# EAGLE design 3DR-APM25-Power-Module-V10 (EAGLE 6.3)
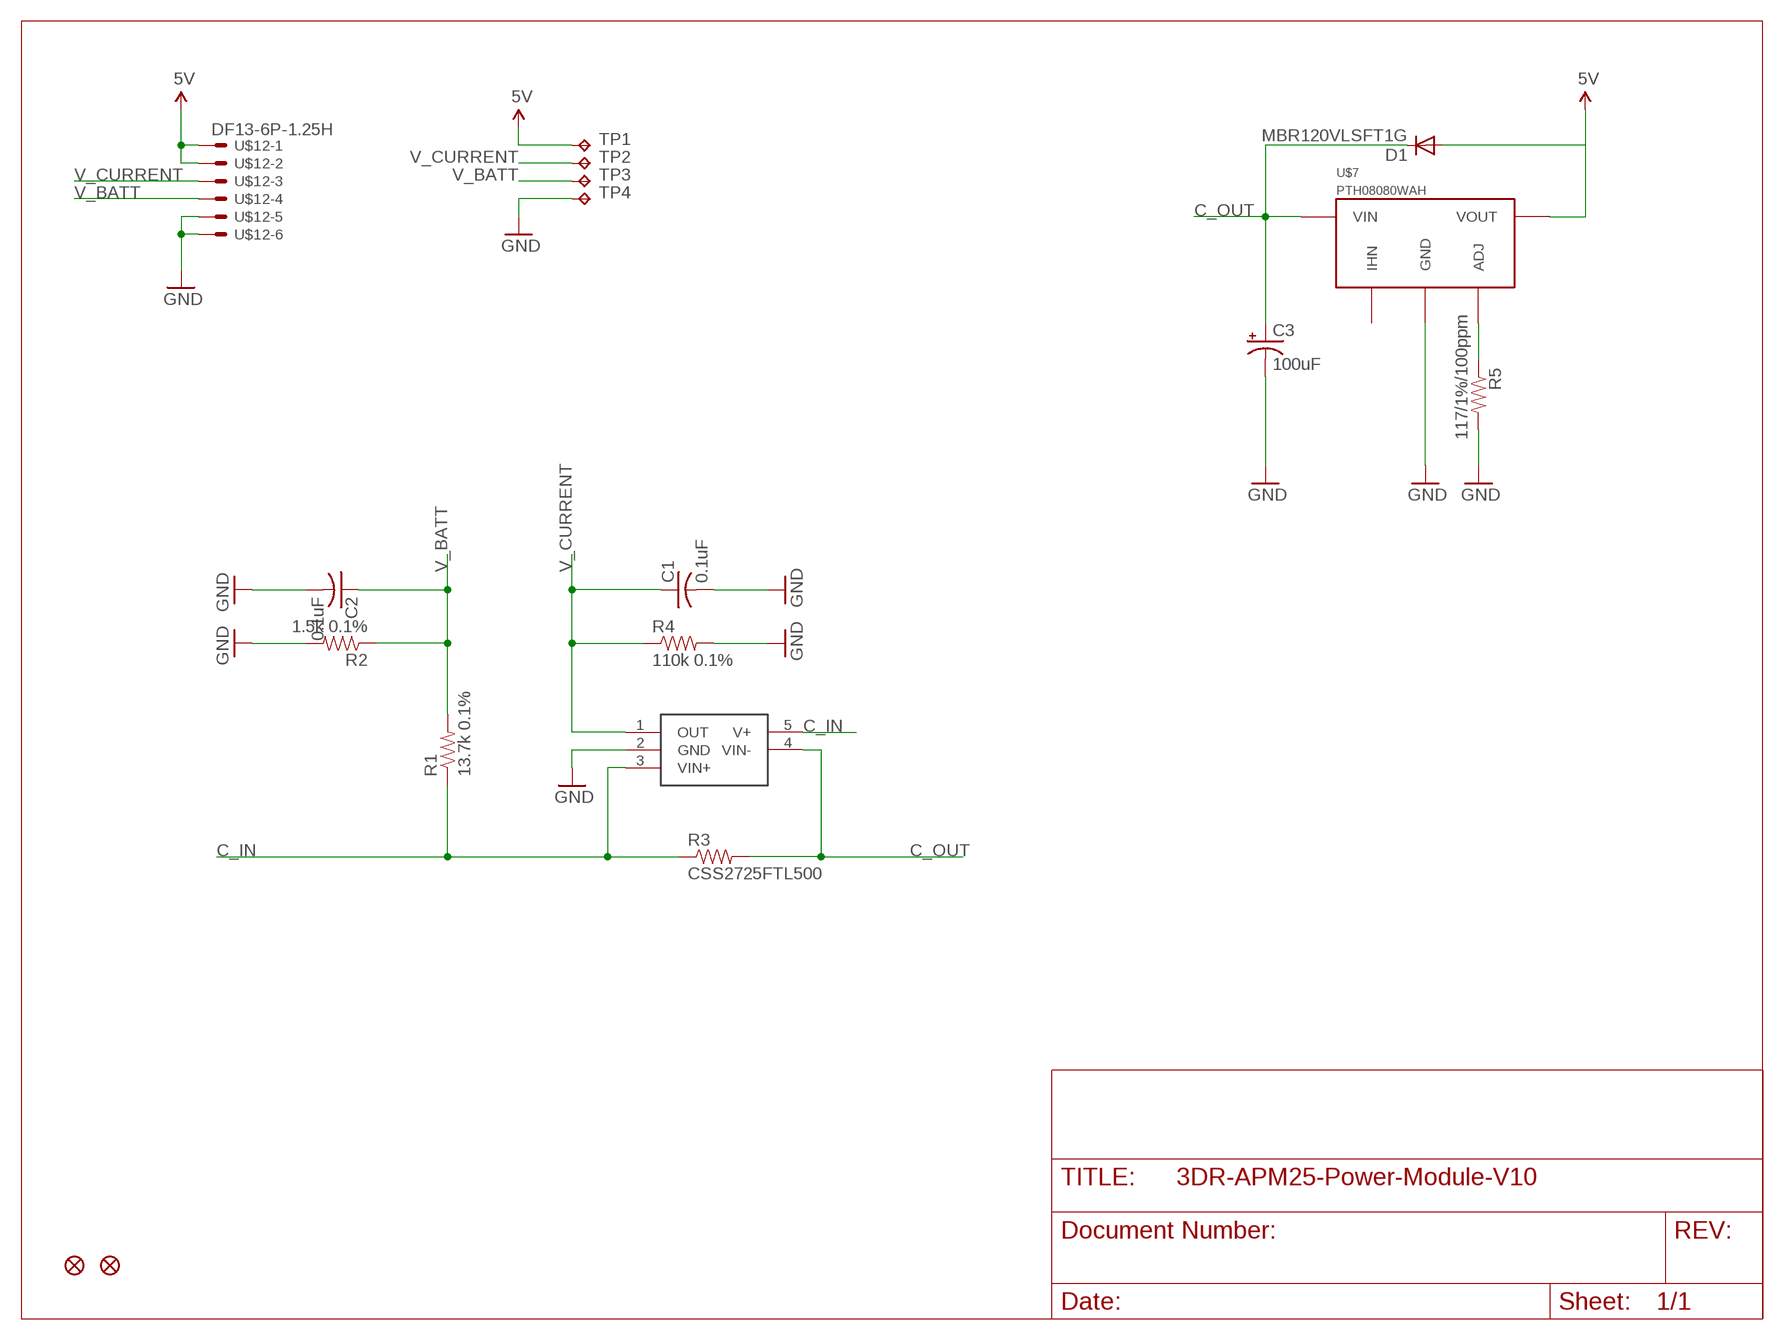
[diagram p0: schematic, sheet 1]

## Parts
C1  0.1uF  C-USC0402  [C0402]
C2  0.1uF  C-USC0402  [C0402]
C3  100uF  CAP_POL7343  [EIA7343]
D1  MBR120VLSFT1G  DIODE-SOD-123  [SOD-123-DIO]
JP1  FIDUCIAL1X2  [FIDUCIAL-1X2]
JP2  FIDUCIAL1X2  [FIDUCIAL-1X2]
R1  13.7k 0.1%  RESISTOR0402-RES  [0402-RES]
R2  1.5k 0.1%  RESISTOR0402-RES  [0402-RES]
R3  CSS2725FTL500  CSS2725FTL250  [2725-RES]
R4  110k 0.1%  RESISTOR0402-RES  [0402-RES]
R5  117/1%/100ppm  RESISTOR0402-RES  [0402-RES]
TP1  TPTP19SQ  [TP19SQ]
TP2  TPTP19SQ  [TP19SQ]
TP3  TPTP19SQ  [TP19SQ]
TP4  TPTP19SQ  [TP19SQ]
U$2  INA169  [SOT23-5]
U$7  PTH08080WAH  [PTH08080W_TH]
U$12  DF13-6P-1.25H  [DF13A-6P-1.25H]

## Nets
C_IN: R1.1 R3.P$1 U$2.3(VIN+) U$2.5(V+)
C_OUT: C3.A(+) D1.C R3.P$2 U$2.4(VIN-) U$7.1(VIN)
GND: C1.2 C2.2 C3.C(-) R2.2 R4.2 R5.2 TP4.TP U$2.2(GND) U$7.2(GND) U$12.5 U$12.6
N$1: R5.1 U$7.4(ADJ)
V_BATT: C2.1 R1.2 R2.1 TP3.TP U$12.4
V_CURRENT: C1.1 R4.1 TP2.TP U$2.1(OUT) U$12.3
VDD_5V: D1.A TP1.TP U$7.3(VOUT) U$12.1 U$12.2 ; supply symbol labelled 5V
Unconnected: U$7.5(IHN)

## Library data of the parts
C1 C2 = adafruit:C-US: CAPACITOR, American symbol
C3 = pixhawk2:CAP_POL: Capacitor Polarized These are standard SMD and PTH capacitors. Normally 10uF, 47uF, and 100uF in electrolytic and tantalum varieties. Always verify the external diameter of the through hole cap, it varies with capacity, voltage, and manufacturer. The EIA devices should be standard.
D1 = pel_dipol_comp:DIODE
JP1 JP2 = SparkFun:FIDUCIAL: Fiducial Alignment Points Various fiducial points for machine vision alignment.
R1 R2 R4 R5 = SparkFun:RESISTOR: Resistor Basic schematic elements and footprints for 0603, 1206, and PTH resistors.
R3 = SparkFun:CSS2725FTL250; DIGIKEY: http://search.digikey.com/us/en/products/CSS2725FTL250/CSS2725FTL250CT-ND/1923235; MFGPN: CSS2725FTL250
TP1-TP4 = testpad:TP: Test pad
U$2 = SparkFun:INA169
U$7 = pixhawk2:PTH08080W: 2.25-A, WIDE-INPUT ADJUSTABLE SWITCHING REGULATOR The input voltage range of the PTH08080W is from 4.5 V to 18 V, allowing operation from either a 5-V or 12-V input bus. Using state-of-the-art switched-mode power-conversion technology, the PTH08080W can step down to voltages as low as 0.9 V from a 5-V input bus, with less than 1 W of power dissipation. The output voltage can be adjusted to any voltage over the range, 0.9 V to 5.5 V, using a single external resistor. Operating features include an undervoltage lockout (UVLO), on/off inhibit, overcurrent protection, and overtemperature protection. http://focus.ti.com/lit/ds/symlink/pth08080w.pdf
U$12 = pixhawk2:DF13-6P-1.25?

## Board
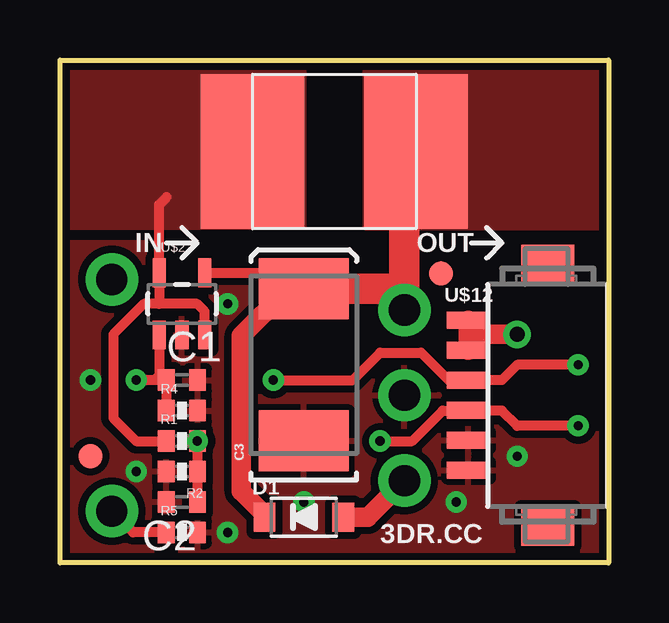
[diagram p1: board, top side]
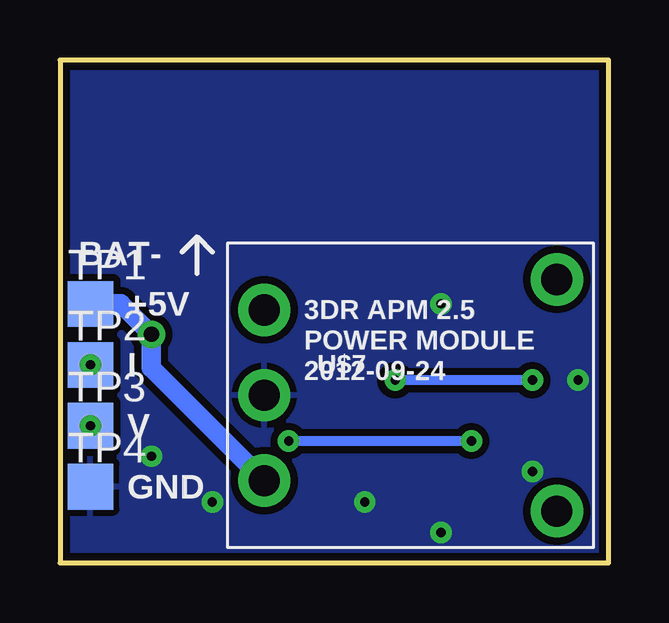
[diagram p2: board, bottom side, seen from below]

Size 22.86 x 20.95 mm. Coordinates in mm from the lower left corner, seen from the top.
Outline: 0,0 0,20.95 22.86,20.95 22.86,0 0,0
Copper layers (1*2*15*16): Top 0.035mm / dielectric 0.5mm / Route2 0.035mm / dielectric 0.5mm / Route15 0.035mm / dielectric 0.5mm / Bottom 0.035mm
Design rules "default": minimum track width 7mil, minimum drill 10mil, track to track 7mil, track to pad 7mil, pad to pad 7mil, via to via 7mil, smd to smd 0mil, copper to edge 10mil, drill to drill 8mil, minimum pad ring 12mil, minimum via ring 10mil, stop-mask expansion 4mil, vias tented up to drill 25mil, thermal gap 10mil

### Footprints (pad centres in the part's own frame; a part is rotated, then mirrored left to right if it is on the bottom)
C0402 = smd 0.7 x 0.9: 1 -0.65,0; 2 0.65,0
EIA7343 = smd 2.55 x 3.75: A 3.17,0; C -3.17,0
SOD-123-DIO = smd 0.91 x 1.22: A 1.64,0; C -1.64,0
FIDUCIAL-1X2 = smd 1 x 1: 1 0,0
0402-RES = smd 0.7 x 0.9: 1 -0.65,0; 2 0.65,0
2725-RES = smd 4.318 x 6.452: P$1 3.404,0; P$2 -3.404,0
TP19SQ = smd 1.9 x 1.9: TP 0,0
SOT23-5 = smd 0.55 x 1.2: 1 -0.95,-1.3; 2 0,-1.3; 3 0.95,-1.3; 4 0.95,1.3; 5 -0.95,1.3
PTH08080W_TH = drill 1.3 pad 2.184: 1 -6.096,3.556; 2 -6.096,0; 3 -6.096,-3.556; 4 6.096,-4.826; 5 6.096,4.826
DF13A-6P-1.25H = smd 0.7 x 1.8: 1 -3.125,-3.3; 2 -1.875,-3.3; 3 -0.625,-3.3; 4 0.625,-3.3; 5 1.875,-3.3; 6 3.125,-3.3 | smd 1.6 x 2.2: S1 5.475,0; S2 -5.475,0

### Placement (x,y rotation side)
C1  5.08,7.62 0 top
C2  5.08,2.54 180 top
C3  10.16,8.26 90 top
D1  10.16,1.91 0 top
JP1  15.88,12.06 0 top
JP2  1.27,4.45 0 top
R1  5.08,5.08 0 top
R2  5.08,3.81 180 top
R3  11.43,17.14 180 top
R4  5.08,6.35 0 top
R5  5.08,1.27 0 top
TP1  21.59,10.79 0 bottom
TP2  21.59,8.26 0 bottom
TP3  21.59,5.71 0 bottom
TP4  21.59,3.17 0 bottom
U$2  5.08,10.79 0 top
U$7  8.26,6.99 0 bottom
U$12  20.32,6.99 270 top

### Tracks (layer width: path | path; a pad name or v marks a point on that pad's centre or on a via)
C_IN
  Top 0.406: 4.13,10.79 4.13,10.8 U$2.5 4.13,14.93 4.45,15.24 | 4.13,10.79 3.49,10.79 2.22,9.53 2.22,6.03 3.17,5.08 R1.1 | U$2.3 6.03,10.48 5.71,10.79 4.13,10.79
  pour Top (isolate 0.305, no thermals): -2.54,13.97 -2.54,22.23 10.16,22.23 10.16,13.97
C_OUT
  Top 0.406: U$2.4 9.49,12.1 C3.A
  Top 0.813: D1.C 8.52,2.02 7.56,2.98 7.56,9.46 9.4,11.3 10.04,11.3 C3.A
  Top 1.27: U$7.1 14.35,11.43 | 14.35,11.43 14.35,16.66 R3.P$2 | C3.A 14.35,11.43
  pour Top (isolate 0.305, no thermals): 12.7,22.23 12.7,13.97 25.4,13.97 25.4,22.23
GND  (via drill 0.38)
  other vias: 3.17,3.81 1.27,7.62 6.99,1.27 6.99,10.79 16.51,2.54 10.16,2.54 19.05,4.45
  pour Bottom (isolate 0.305): -6.99,0 -6.99,23.5 28.57,23.5 28.57,0
  pour Top (isolate 0.305): -2.54,13.34 -2.54,0 25.4,0 25.4,13.34
N$1
  Top 0.406: R5.1 3.05,1.27 U$7.4
V_BATT  (via drill 0.38)
  Top 0.406: C2.1 R2.1 R1.2 v5.71,5.08 | TP3.TP 19.05,5.71 18.41,6.35 U$12.4 15.94,6.35 14.67,5.08 v13.34,5.08
  Bottom 0.406: v5.71,5.08 v13.34,5.08
  other vias: 21.59,5.71
V_CURRENT  (via drill 0.38)
  Top 0.406: R4.1 C1.1 3.94,7.62 | 3.94,7.62 v3.17,7.62 | v8.89,7.62 12.19,7.62 13.34,8.76 15.05,8.76 16.19,7.62 U$12.3 18.41,7.62 19.05,8.26 TP2.TP | U$2.1 4.13,7.81 3.94,7.62
  Bottom 0.406: v3.17,7.62 v8.89,7.62
  other vias: 21.59,8.26
VDD_5V  (via drill 0.64)
  Top 0.813: U$12.1 17.02,9.53 | 17.02,9.53 U$12.2 | v19.05,9.53 17.02,9.53 | U$7.3 12.83,1.91 D1.A
  Bottom 0.813: TP1.TP 20.32,10.79 v19.05,9.53 19.05,8.13 U$7.3

### Text on the board
tPlace: IN | OUT | 3DR.CC
bPlace: BAT- | 3DR APM 2.5 | +5V | POWER MODULE | 2012-09-24 | I | V | GND